# EAGLE schematic Transistor_ckt (EAGLE 9.6.2)
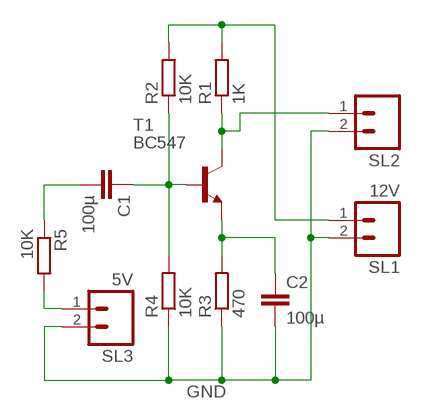
[diagram p0: schematic, sheet 1]

## Parts
C1  100µ  C-EU025-025X050  [C025-025X050]
C2  100µ  C-EU025-025X050  [C025-025X050]
R1  1K  R-EU_0204/7  [0204/7]
R2  10K  R-EU_0204/7  [0204/7]
R3  470  R-EU_0204/7  [0204/7]
R4  10K  R-EU_0204/7  [0204/7]
R5  10K  R-EU_0204/7  [0204/7]
SL1  12V  M02  [02P]
SL2  M02  [02P]
SL3  5V  M02  [02P]
T1  BC547  [TO92]

## Nets
GND: C2.2 R3.1 R4.1 SL1.2 SL2.2 SL3.2
N$1: R1.2 R2.2 SL1.1
N$2: R1.1 SL2.1 T1.3(C)
N$3: C2.1 R3.2 T1.1(E)
N$4: C1.2 R5.1
N$5: C1.1 R2.1 R4.2 T1.2(B)
N$10: R5.2 SL3.1

## Library data of the parts
C1 C2 = rcl:C-EU: CAPACITOR, European symbol; SPICEPREFIX: C
R1-R5 = rcl:R-EU_: RESISTOR, European symbol; SPICEPREFIX: R
SL1-SL3 = con-amp-quick:M02: AMP QUICK CONNECTOR; OC_FARNELL: unknown; OC_NEWARK: unknown
T1 = transistor:BC547: NPN TRANSISTOR